# Altium schematic sheet boxer_I2C_diff.SchDoc: Differential I2C
size A4; DrawnBy: Damian Dolewski; Engineer: Damian Dolewski; DocumentNumber: 5; SheetNumber: 7; SheetTotal: 7
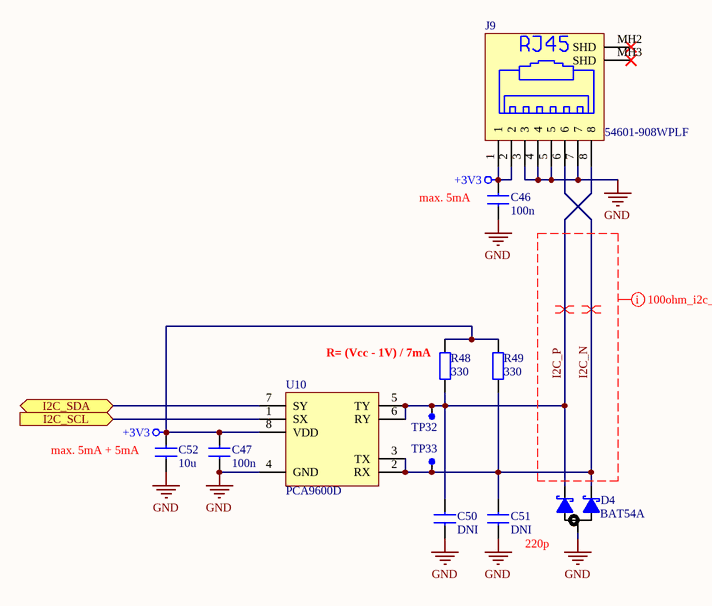
[diagram p0: boxer_I2C_diff.SchDoc]

## Parts
C46  value 100n  [C_0805]  (hidden comment: Capacitor)
C47  value 100n  [C_0805]  (hidden comment: Capacitor)
C50  value DNI  [C_0805]  (hidden comment: Capacitor)
C51  value DNI  [C_0805]  (hidden comment: Capacitor)
C52  value 10u  [C_1206]  (hidden comment: Capacitor)
D4  BAT54A  [SOT-23]
J9  54601-908WPLF  [RJ45_54601-908WPLF]
R48  value 330  [R_0805]  (hidden comment: Resistor)
R49  value 330  [R_0805]  (hidden comment: Resistor)
TP32  TEST PAD  [PIN]  (value not drawn)
TP33  TEST PAD  [PIN]  (value not drawn)
U10  PCA9600D  [SO8]

## Ports
I2C_SCL (in), I2C_SDA (bidir)

## Nets
+3V3: C46.2 C47.2 C52.2 J9.1 J9.2 R48.2 R49.2 U10.8(VDD)
GND: C46.1 C47.1 C50.1 C51.1 C52.1 D4.3(K) J9.3 J9.4 J9.5 J9.7 U10.4(GND)
I2C_N: C51.2 D4.1(A) J9.6 R49.1 TP33.1 U10.2(RX) U10.3(TX)
I2C_P: C50.2 D4.2(A) J9.8 R48.1 TP32.1 U10.5(TY) U10.6(RY)
I2C_SCL: U10.1(SX) ; port I2C_SCL
I2C_SDA: U10.7(SY) ; port I2C_SDA

Not connected (* = marked no-connect by the designer): J9 MH2(SHD)* MH3(SHD)*

## Layout directives
differential pair: I2C_N, I2C_P
mark named 100ohm_i2c_diff: I2C_N, I2C_P

## Notes on the sheet
- (near C46) max. 5mA
- (near R48) R= (Vcc - 1V) / 7mA
- (near C52) max. 5mA + 5mA
- 220p
- Title:
- Size:
- A4
- Number:
- Revision:
- Date:
- File:
- Sheet
- of

## Library data of the parts
D4 = Diode Schottky3: dual Schottky diode common anode; Value: BAT54A
J9 = RJ45-8: RJ45 Socket, 8pin, No Key, Molex MX-95001-2881; Value: 54601-908WPLF
TP32 TP33 = TEST_PAD
U10 = PCA9600: Dual bidirectional I2C bus buffer; Value: PCA9600D